# EAGLE schematic OpAmpDriver (EAGLE 9.6.0)
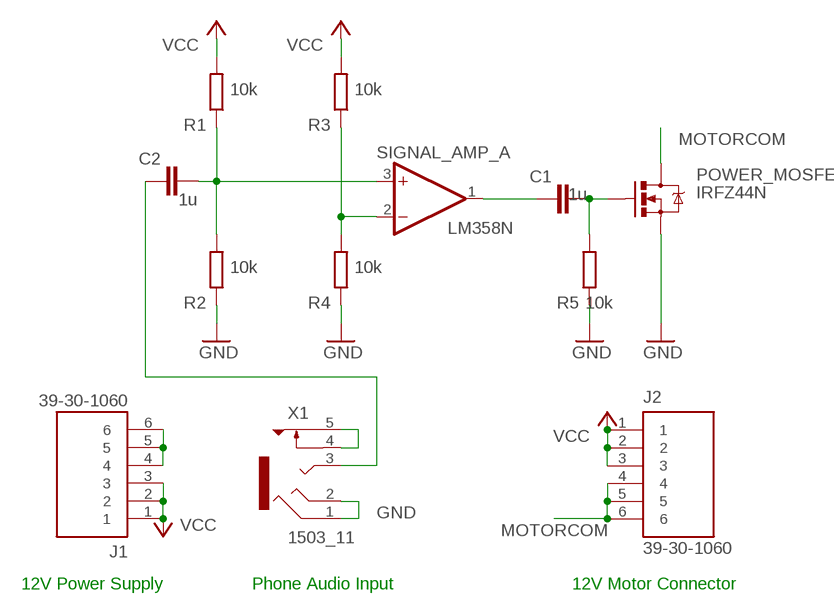
[diagram p0: schematic, sheet 1]

## Parts
C1  1u  C-EU025-025X050  [C025-025X050]
C2  1u  C-EU025-025X050  [C025-025X050]
J1  39-30-1060  [MOLEX_39-30-1060]
J2  39-30-1060  [MOLEX_39-30-1060]
POWER_MOSFET  IRFZ44N  [TO-220]
R1  10k  R-EU_0204/7  [0204/7]
R2  10k  R-EU_0204/7  [0204/7]
R3  10k  R-EU_0204/7  [0204/7]
R4  10k  R-EU_0204/7  [0204/7]
R5  10k  R-EU_0204/7  [0204/7]
SIGNAL_AMP_  LM358N  [DIL08]
X1  1503_11  [1503_11]

## Nets
GND: POWER_MOSFET.3(S) R2.1 R4.1 R5.1 X1.1 X1.2
MOTORCOM: J2.4 J2.5 J2.6 POWER_MOSFET.2(D)
N$1: C2.2 R1.1 R2.2 SIGNAL_AMP_.3(A:+IN)
N$2: R3.1 R4.2 SIGNAL_AMP_.2(A:-IN)
N$3: C1.1 SIGNAL_AMP_.1(A:OUT)
N$4: C1.2 POWER_MOSFET.1(G) R5.2
N$6: X1.4 X1.5
N$7: C2.1 X1.3
N$9: J1.4 J1.5 J1.6
VCC: J1.1 J1.2 J1.3 J2.1 J2.2 J2.3 R1.2 R3.2
Unconnected: SIGNAL_AMP_.5(B:+IN) SIGNAL_AMP_.6(B:-IN) SIGNAL_AMP_.7(B:OUT)

## Notes on the sheet
- 12V Power Supply | Phone Audio Input | 12V Motor Connector

## Power pins joined to a net without a drawn wire
V+: SIGNAL_AMP_.8(P:V+)
V-: SIGNAL_AMP_.4(P:V-)

## Library data of the parts
C1 C2 = rcl:C-EU: CAPACITOR, European symbol; SPICEPREFIX: C
J1 J2 = 39-30-1060:39-30-1060: Conn Power HDR 6 POS 4.2mm Solder RA Thru-Hole 6 Terminal 1 Port Mini-Fit; AVAILABILITY: Unavailable; DESCRIPTION: Connector Header Through Hole, Right Angle 6 position 0.165 _4.20mm_; MF: Molex; MP: 39-30-1060; PACKAGE: None; PRICE: None
POWER_MOSFET = IRFZ44N:IRFZ44N; AVAILABILITY: Unavailable; DESCRIPTION: N-Channel 55V 49A _Tc_ 3.8W _Ta_, 94W _Tc_ Surface Mount D2PAK; MF: Infineon Technologies; MP: IRFZ44N; PACKAGE: D2PAK NXP Semiconductors; PRICE: None
R1-R5 = rcl:R-EU_: RESISTOR, European symbol; SPICEPREFIX: R
SIGNAL_AMP_ = linear:LM358: OP AMP also LM158; LM258; LM2904 Source: http://cache.national.com/ds/LM/LM158.pdf
X1 = con-lumberg:1503_11: Jack connectors according to JISC 6560, 3.5 mm Klinkeneinbaukupplung nach JISC 6560, 3,5 mm, 3-polig/ stereo, stehende Ausführung, mit Öffner, für Leiterplatten Source: http://www.lumberg.com/Produkte/PDFs/1503_11.pdf; OC_FARNELL: 1308869; OC_NEWARK: unknown